# Altium schematic sheet LightSensor.SchDoc
size A4
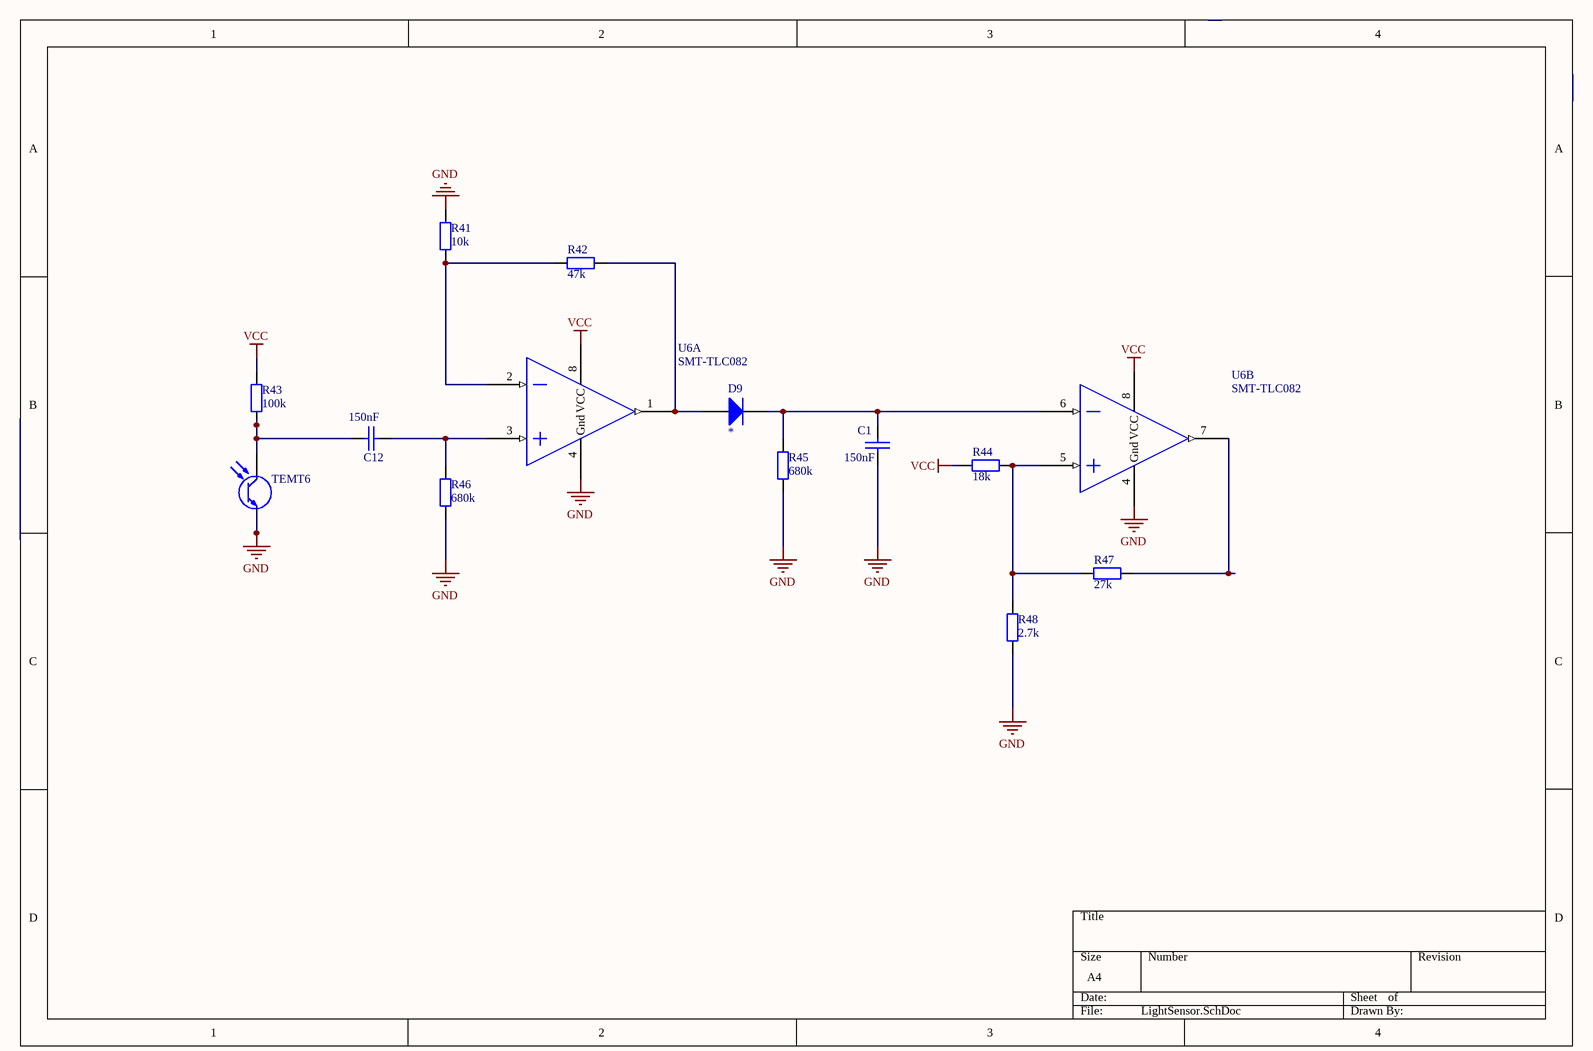
[diagram p0: LightSensor.SchDoc]

## Parts
C1  150nF  [ECE-CAPC1608-0603SM]
C12  150nF  [ECE-CAPC1608-0603SM]
D9  *  [ece-DIODE0.4]
R41  10k  [RESC2012-0805SM]
R42  47k  [RESC2012-0805SM]
R43  100k  [RESC2012-0805SM]
R44  18k  [RESC2012-0805SM]
R45  680k  [RESC2012-0805SM]
R46  680k  [RESC2012-0805SM]
R47  27k  [RESC2012-0805SM]
R48  2.7k  [RESC2012-0805SM]
TEMT6  TEMT6200  [ECE-SENSOR-0805SM]  (value not drawn)
U6  SMT-TLC082  [SO-8]  (parts A,B of 2)

## Nets
GND: C1.2 R41.2 R45.1 R46.1 R48.1 TEMT6.1(E) U6.4(Gnd)
VCC: R43.2 R44.2 U6.8(VCC)
NetC1_1: C1.1 D9.2(K) R45.2 U6.6(IN2(-))
NetC12_1: C12.1 R43.1 TEMT6.2(C)
NetC12_2: C12.2 R46.2 U6.3(IN1(+))
NetD9_1: D9.1(A) R42.1 U6.1(OUT1)
NetR41_1: R41.1 R42.2 U6.2(IN1(-))
NetR44_1: R44.1 R47.2 R48.2 U6.5(IN2(+))
NetR47_1: R47.1 U6.7(OUT2)

## Library data of the parts
C1 = CAP000625: CAP CER 150nF 25V X7R SM0603; Manufactuer: TDK; Manufacturer-PN: C1608X7R1E154K080AA; Assembly Method: Surface Mount; Item Type: Item; Path: ece/ts/Lists/Stock Inventory; Value: 150nF; UoA Stock#: CAP000625; Size/Package: 0603 (1608 Metric); Voltage/Current: 25V; Supplier1: Digikey; Supplier1-PN: 445-5190-2-ND; Component Type: CAP-0603-150nF; Category: Capacitor; Status: Active
C12 = CAP000619: CAP CER 15nF 50V X7R SM0603; Manufactuer: Samsung; Manufacturer-PN: CL10B153KB8NNNC; Assembly Method: Surface Mount; Item Type: Item; Path: ece/ts/Lists/Stock Inventory; Value: 15nF; UoA Stock#: CAP000619; Size/Package: 0603 (1608 Metric); Voltage/Current: 50V; Supplier1: Digikey; Supplier1-PN: 1276-1277-2-ND; Component Type: CAP-0603-15nF; Category: Capacitor; Status: Active
D9 = DIODE: High Conductance Fast Diode; Manufacturer: Fairchild Semiconductor; Revision 1: 11-July-2000: SIM Model Added.; Revision 2: July-2002: Re-released for DXP Platform.; Class I: Discrete; Class II: Diode - Switching; Published: 8-Jun-2000; Datasheet: Latest Revision: 1997; Package Reference: DO-35; Publisher: Altium Limited; Value: *
R41-R48 = Res SM 0805: SM resistor
  R41: Value: 10k
  R42: Value: 47k
  R43: Value: 100k
  R44: Value: 18k
  R45 R46: Value: 680k
  R47: Value: 27k
  R48: Value: 2.7k
TEMT6 = OTH000001: LIGHT SENSOR TEMT6200 SM; Manufactuer: Vishay; Manufacturer-PN: TEMT6200FX01; Assembly Method: Surface Mount; Item Type: Item; Path: ece/ts/Lists/Stock Inventory; Revision: July-2002: Re-released for DXP Platform.; UoA Stock#: OTH000001; Value: TEMT6200; Size/Package: 0805/2012; Datasheet Link: http://share.engineering.auckland.ac.nz/ece/ts/Student%20Documents/temt6200.pdf; Supplier1: Digikey; Supplier1-PN: 751-1056-1-ND; Component Type: SEN-0805-TEMT6200; Category: Other; Status: Non Stocked